# EasyEDA schematic SCH_arduino-nano-every-sheild_2024-02-21.json
TITLE: Sheet_1; REV: 1.0; Date: 2024-02-08; Sheet: 1/1; Drawn By: arnav.purbiya; Company: Your Company
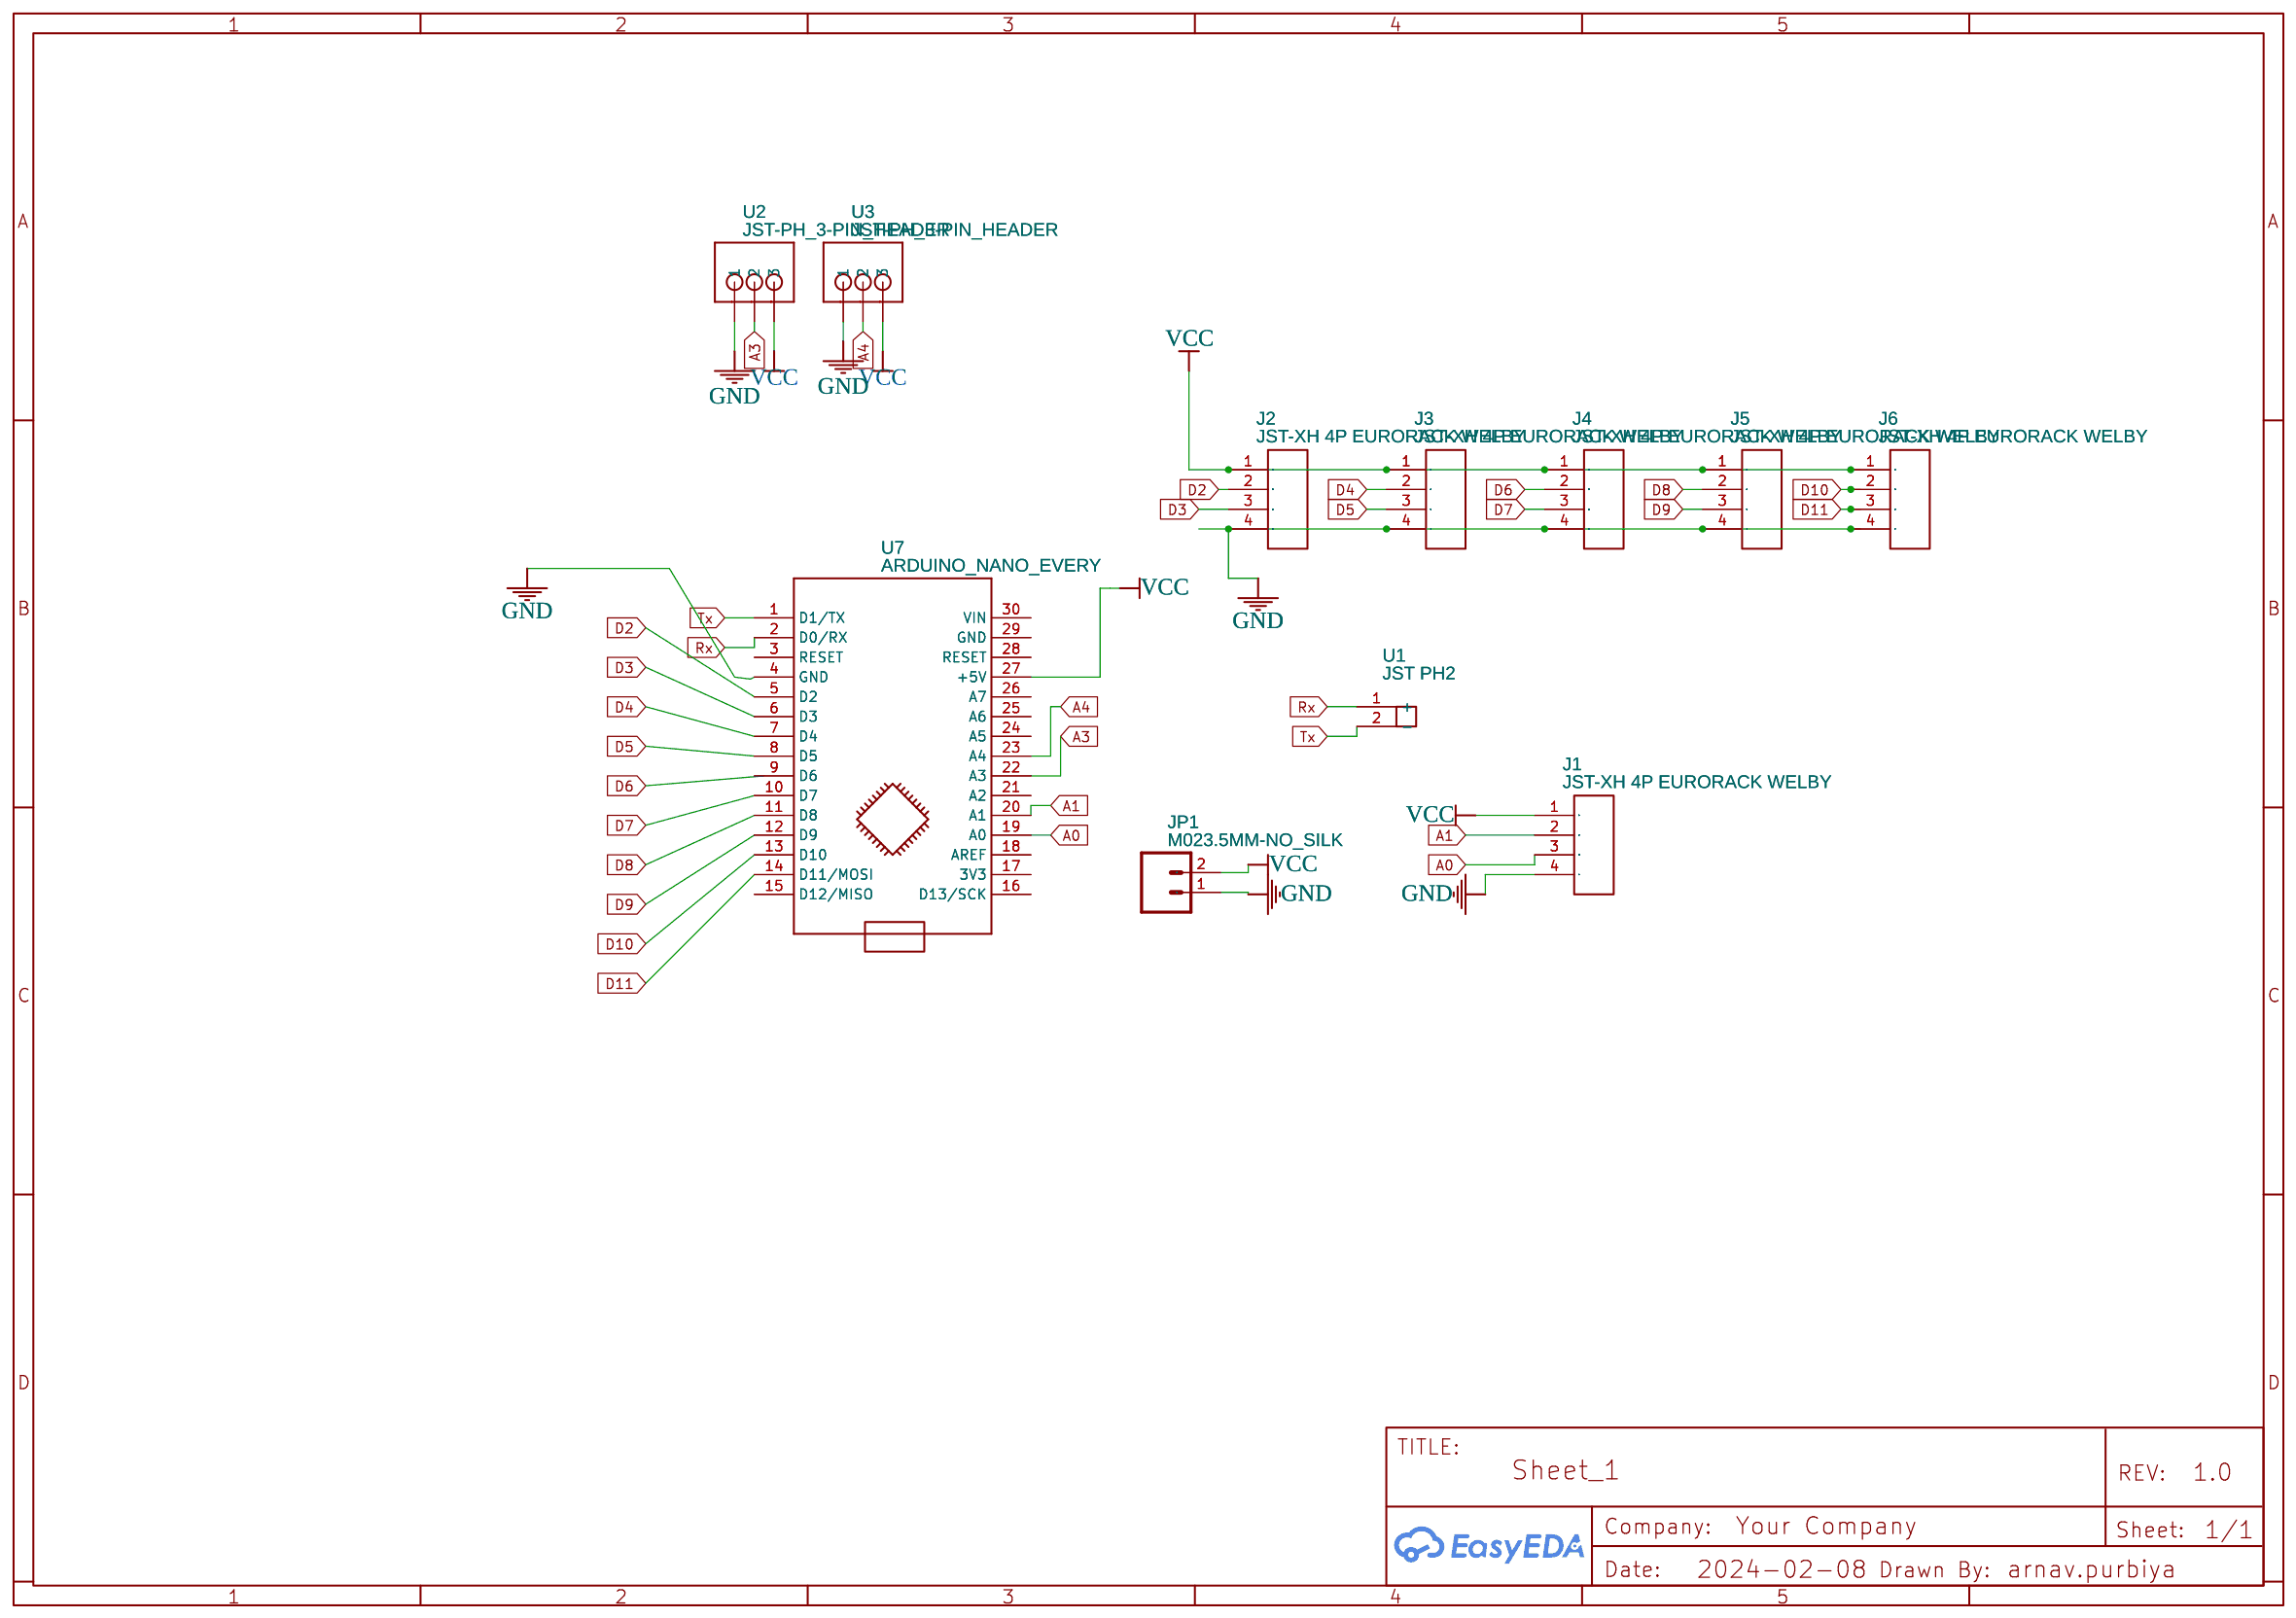
[diagram p0: schematic sheet]

## Parts
J1  JST-XH 4P EURORACK WELBY  [4PIN_2.54_MM_JST_XHP_JST_CONNECTOR_FOR_DC_SOCKET]
J2  JST-XH 4P EURORACK WELBY  [4PIN_2.54_MM_JST_XHP_JST_CONNECTOR_FOR_DC_SOCKET]
J3  JST-XH 4P EURORACK WELBY  [4PIN_2.54_MM_JST_XHP_JST_CONNECTOR_FOR_DC_SOCKET]
J4  JST-XH 4P EURORACK WELBY  [4PIN_2.54_MM_JST_XHP_JST_CONNECTOR_FOR_DC_SOCKET]
J5  JST-XH 4P EURORACK WELBY  [4PIN_2.54_MM_JST_XHP_JST_CONNECTOR_FOR_DC_SOCKET]
J6  JST-XH 4P EURORACK WELBY  [4PIN_2.54_MM_JST_XHP_JST_CONNECTOR_FOR_DC_SOCKET]
JP1  M023.5MM-NO_SILK  [SCREWTERMINAL-3.5MM-2-NS]
U1  JST PH2  [JST-PH-JST-PH2]
U2  JST-PH_3-PIN_HEADER  [JST_B3B-PH_HEADER]
U3  JST-PH_3-PIN_HEADER  [JST_B3B-PH_HEADER]
U7  ARDUINO_NANO_EVERY  [ARDUINO_NANO_EVERY]

## Library data of the parts
J1-J6 = JST-XH 4P EURORACK WELBY: Contributor: moorpcbs
JP1 = M023.5MM-NO_SILK: Contributor: Matthew Wright
U1 = JST PH2: Contributor: pwarrow99
U2 U3 = JST-PH_3-PIN_HEADER
U7 = ARDUINO_NANO_EVERY: sourceId: KGSeAWhDB

## Nets
GND: J1.4 J2.4 J3.4 J4.4 J5.4 J6.4 JP1.1 U2.P1(1) U3.P1(1) U7.4(GND)
VCC: J1.1 J2.1 J3.1 J4.1 J5.1 J6.1 JP1.2 U2.P3(3) U3.P3(3) U7.27(+5V)
A0: J1.3 U7.19(A0)
A1: J1.2 U7.20(A1)
A3: U2.P2(2) U7.22(A3)
A4: U3.P2(2) U7.23(A4)
D2: J2.2 U7.5(D2)
D3: J2.3 U7.6(D3)
D4: J3.2 U7.7(D4)
D5: J3.3 U7.8(D5)
D6: J4.2
D7: J4.3 U7.10(D7)
D8: J5.2 U7.11(D8)
D9: J5.3 U7.12(D9)
D10: J6.2 U7.13(D10)
D11: J6.3 U7.14(D11/MOSI)
Rx: U1.1(+) U7.2(D0/RX)
Tx: U1.2(-) U7.1(D1/TX)

Not connected (* = marked no-connect by the designer): U7 3(RESET) 9(D6) 15(D12/MISO) 16(D13/SCK) 17(3V3) 18(AREF) 21(A2) 24(A5) 25(A6) 26(A7) 28(RESET) 29(GND) 30(VIN)
